# EasyEDA schematic ironman.json
TITLE: Sheet_1; REV: 1.0; Date: 2022-01-20; Sheet: 1/1; Drawn By: Rodney Osodo; Company: Your Company
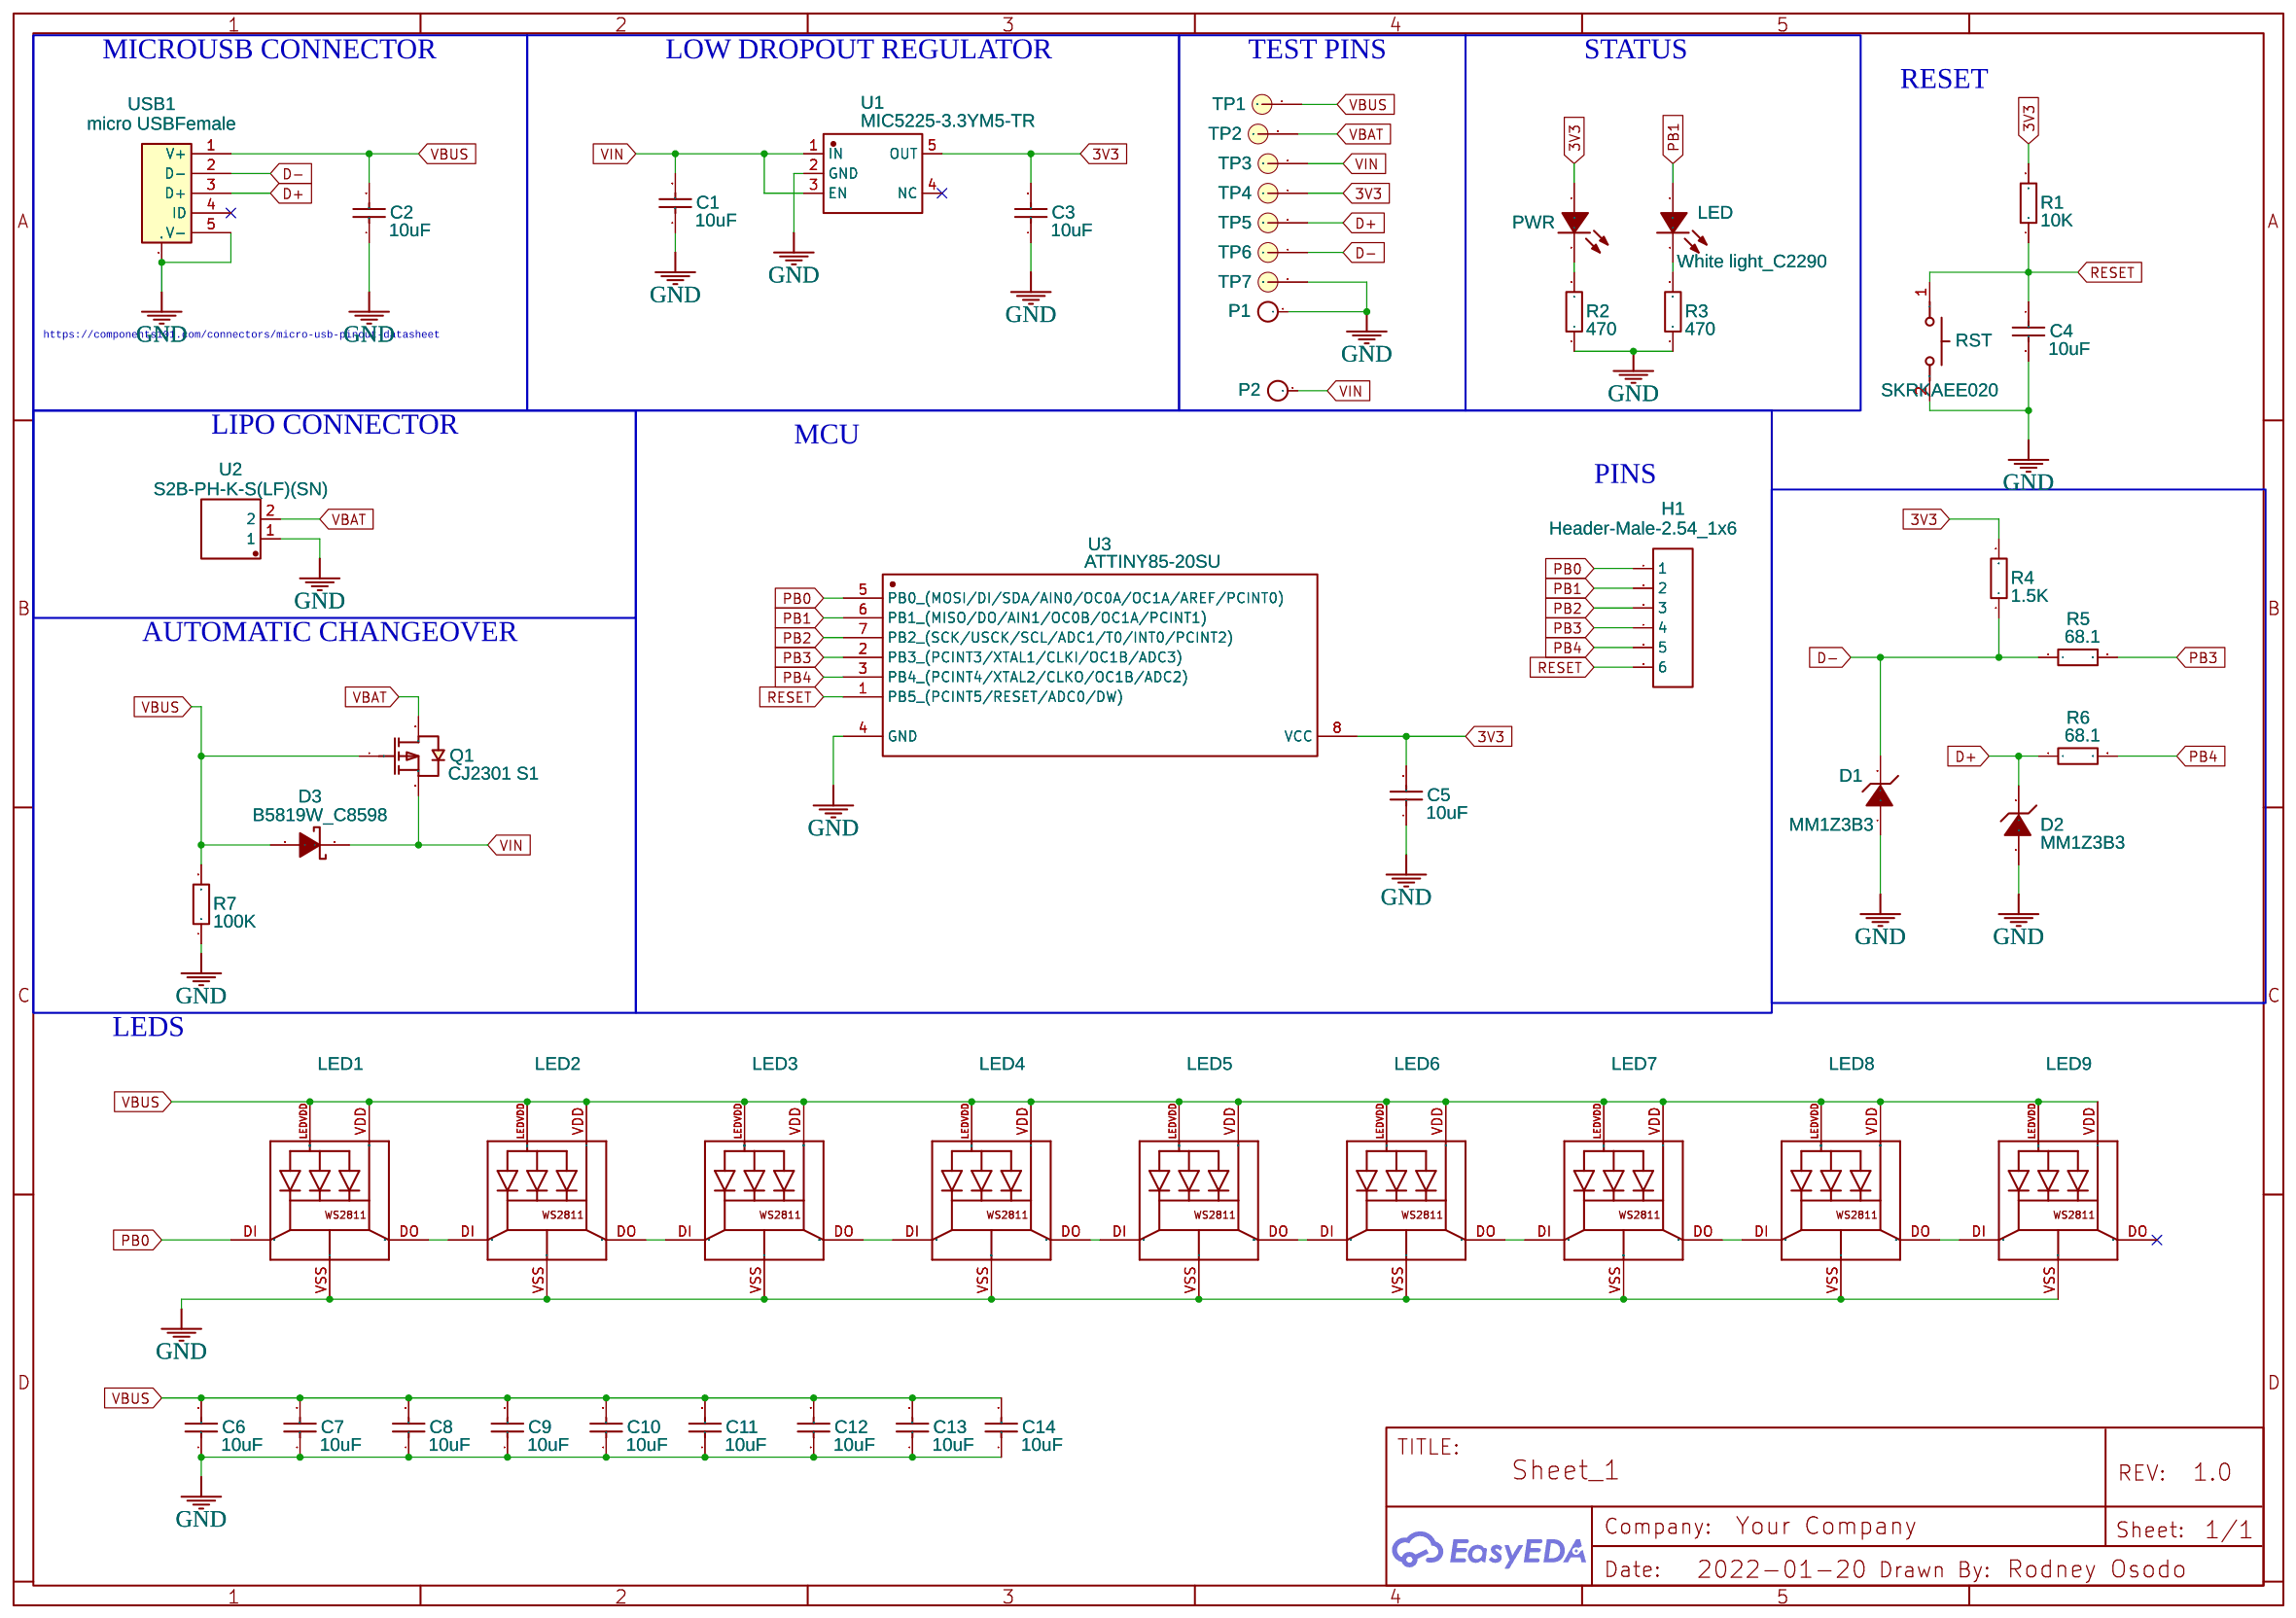
[diagram p0: schematic sheet]

## Parts
C1  10uF  [C0402]
C2  10uF  [C0402]
C3  10uF  [C0402]
C4  10uF  [C0402]
C5  10uF  [C0402]
C6  10uF  [C0402]
C7  10uF  [C0402]
C8  10uF  [C0402]
C9  10uF  [C0402]
C10  10uF  [C0402]
C11  10uF  [C0402]
C12  10uF  [C0402]
C13  10uF  [C0402]
C14  10uF  [C0402]
D1  MM1Z3B3  [SOD-123_L2.8-W1.8-LS3.7-FD]
D2  MM1Z3B3  [SOD-123_L2.8-W1.8-LS3.7-FD]
D3  B5819W_C8598  [SOD-123_L2.7-W1.6-LS3.7-RD-1]
H1  Header-Male-2.54_1x6  [HDR-TH_6P-P2.54-V-M-1]
LED  White light_C2290  [LED0603-R-RD_WHITE]
LED1  WS28115050  [WS28115050]
LED2  WS28115050  [WS28115050]
LED3  WS28115050  [WS28115050]
LED4  WS28115050  [WS28115050]
LED5  WS28115050  [WS28115050]
LED6  WS28115050  [WS28115050]
LED7  WS28115050  [WS28115050]
LED8  WS28115050  [WS28115050]
LED9  WS28115050  [WS28115050]
P1  3MMHOLE_PTH COPY  [3MMHOLE_PTH]
P2  3MMHOLE_PTH COPY  [3MMHOLE_PTH]
PWR  White light_C2290  [LED0603-R-RD_WHITE]
Q1  CJ2301 S1  [SOT-23-3_L3.0-W1.7-P0.95-LS2.9-BR]
R1  10K  [R0603]
R2  470  [R0603]
R3  470  [R0603]
R4  1.5K  [R0603]
R5  68.1  [R0603]
R6  68.1  [R0603]
R7  100K  [R0603]
RST  SKRKAEE020  [SW-SMD_L3.9-W3.0-P4.45]
TP1  TEST PINS  [TESTPIN]
TP2  TEST PINS  [TESTPIN]
TP3  TEST PINS  [TESTPIN]
TP4  TEST PINS  [TESTPIN]
TP5  TEST PINS  [TESTPIN]
TP6  TEST PINS  [TESTPIN]
TP7  TEST PINS  [TESTPIN]
U1  MIC5225-3.3YM5-TR  [SOT-23-5_L3.0-W1.7-P0.95-LS2.8-BR]
U2  S2B-PH-K-S(LF)(SN)  [CONN-TH_S2B-PH-K-S-LF-SN]
U3  ATTINY85-20SU  [SOIC-8_L5.3-W5.3-P1.27-LS8.0-BL]
USB1  micro USBFemale  [MICRO-USB-SMD_5P-P0.65-H-F_C10418]

## Library data of the parts
C1-C14 = CL05A106MQ5NUNC: Supplier: LCSC; Manufacturer: SAMSUNG; Supplier Part: C15525; JLCPCB Part Class: Basic Part
D1 D2 = MM1Z3B3: Supplier: LCSC; Manufacturer: SEMTECH; Supplier Part: C108453; JLCPCB Part Class: Extended Part
D3 = B5819W_C8598: Supplier: LCSC; Manufacturer: CJ; Manufacturer Part: B5819W; Supplier Part: C8598; JLCPCB Part Class: Basic Part
H1 = Header-Male-2.54_1x6: Supplier: LCSC; Manufacturer: BOOMELE; Supplier Part: C37208; JLCPCB Part Class: Extended Part
LED PWR = 0603White light_C2290: Supplier: LCSC; Manufacturer: KENTO; Manufacturer Part: 0603White light; Supplier Part: C2290; JLCPCB Part Class: Basic Part
LED1-LED9 = WS28115050: Contributor: gtanaka6
P1 P2 = 3MMHOLE_PTH COPY: Contributor: Components
Q1 = CJ2301 S1: Supplier: LCSC; Manufacturer: CJ; Supplier Part: C8547; JLCPCB Part Class: Extended Part
R1 = 0603WAJ0103T5E: Supplier: LCSC; Manufacturer: UniOhm; Supplier Part: C15401; JLCPCB Part Class: Extended Part
R2 R3 = 0603WAF4700T5E: Supplier: LCSC; Manufacturer: UniOhm; Supplier Part: C23179; JLCPCB Part Class: Basic Part
R4 = 0603WAF1501T5E: Supplier: LCSC; Manufacturer: UniOhm; Supplier Part: C22843; JLCPCB Part Class: Basic Part
R5 R6 = 0603WAF681JT5E: Supplier: LCSC; Manufacturer: UniOhm; Supplier Part: C23097; JLCPCB Part Class: Extended Part
R7 = RC0603JR-07100KL: Supplier: LCSC; Supplier Part: C100048; Manufacturer: YAGEO; Contributor: LCSC; JLCPCB Part Class: Extended Part
RST = SKRKAEE020: Supplier: LCSC; Manufacturer: ALPS; Supplier Part: C115357; JLCPCB Part Class: Extended Part
TP1-TP7 = TestPin: Contributor: Bruno Rivera
U1 = MIC5225-3.3YM5-TR: Supplier: LCSC; Supplier Part: C512101; Manufacturer: Microchip Tech; Contributor: LCSC; JLCPCB Part Class: Extended Part
U2 = S2B-PH-K-S(LF)(SN): Supplier: LCSC; Supplier Part: C173752; Manufacturer: JST Sales America; Contributor: LCSC; JLCPCB Part Class: Extended Part
U3 = ATTINY85-20SU: Supplier: LCSC; Manufacturer: MICROCHIP; Supplier Part: C89852; JLCPCB Part Class: Extended Part
USB1 = micro USBFemale: Supplier: LCSC; Manufacturer: ValuePro; image: //image.lceda.cn/szlcsc/C10418.jpg; Supplier Part: C10418

## Nets
3V3: C3.2 C5.2 PWR.1(A) R1.2 R4.2 TP4.1 U1.5(OUT) U3.8(VCC)
GND: C1.1 C2.1 C3.1 C4.2 C5.1 C6.1 C7.1 C8.1 C9.1 C10.1 C11.1 C12.1 C13.1 C14.1 D1.1(A) D2.1(A) LED1.VSS(GND) LED2.VSS(GND) LED3.VSS(GND) LED4.VSS(GND) LED5.VSS(GND) LED6.VSS(GND) LED7.VSS(GND) LED8.VSS(GND) LED9.VSS(GND) P1.1 R2.1 R3.1 R7.1 RST.2 TP7.1 U1.2(GND) U2.1 U3.4(GND) USB1.0(MTN) USB1.5(V-)
VBAT: Q1.3(D) TP2.1 U2.2
VBUS: C2.2 C6.2 C7.2 C8.2 C9.2 C10.2 C11.2 C12.2 C13.2 C14.2 D3.2(+) LED1.LEDVDD LED1.VDD LED2.LEDVDD LED2.VDD LED3.LEDVDD LED3.VDD LED4.LEDVDD LED4.VDD LED5.LEDVDD LED5.VDD LED6.LEDVDD LED6.VDD LED7.LEDVDD LED7.VDD LED8.LEDVDD LED8.VDD LED9.LEDVDD LED9.VDD Q1.1(G) R7.2 TP1.1 USB1.1(V+)
VIN: C1.2 D3.1(-) P2.1 Q1.2(S) TP3.1 U1.1(IN) U1.3(EN)
D+: D2.2(K) R6.1 TP5.1 USB1.3(D+)
D-: D1.2(K) R4.1 R5.1 TP6.1 USB1.2(D-)
PB0: H1.1 LED1.DI U3.5(PB0 (MOSI/DI/SDA/AIN0/OC0A/OC1A/AREF/PCINT0))
PB1: H1.2 LED.1(A) U3.6(PB1 (MISO/DO/AIN1/OC0B/OC1A/PCINT1))
PB2: H1.3 U3.7(PB2 (SCK/USCK/SCL/ADC1/T0/INT0/PCINT2))
PB3: H1.4 R5.2 U3.2(PB3 (PCINT3/XTAL1/CLKI/OC1B/ADC3))
PB4: H1.5 R6.2 U3.3(PB4 (PCINT4/XTAL2/CLKO/OC1B/ADC2))
RESET: C4.1 H1.6 R1.1 RST.1 U3.1(PB5 (PCINT5/RESET/ADC0/DW))
Net-(LED1-DO): LED1.DO LED2.DI
Net-(LED2-DO): LED2.DO LED3.DI
Net-(LED3-DO): LED3.DO LED4.DI
Net-(LED4-DO): LED4.DO LED5.DI
Net-(LED5-DO): LED5.DO LED6.DI
Net-(LED6-DO): LED6.DO LED7.DI
Net-(LED7-DO): LED7.DO LED8.DI
Net-(LED8-DO): LED8.DO LED9.DI
Net-(LED-2): LED.2(K) R3.2
Net-(PWR-2): PWR.2(K) R2.2

Not connected (* = marked no-connect by the designer): LED9 DO*; U1 4(NC)*; USB1 4(ID)*

## Notes on the sheet
- MICROUSB CONNECTOR
- LOW DROPOUT REGULATOR
- TEST PINS
- STATUS
- RESET
- https://components101.com/connectors/micro-usb-pinout-datasheet
- LIPO CONNECTOR
- MCU
- PINS
- AUTOMATIC CHANGEOVER
- LEDS
